# EAGLE design voltage-selector-and-output (EAGLE 7.4.0)
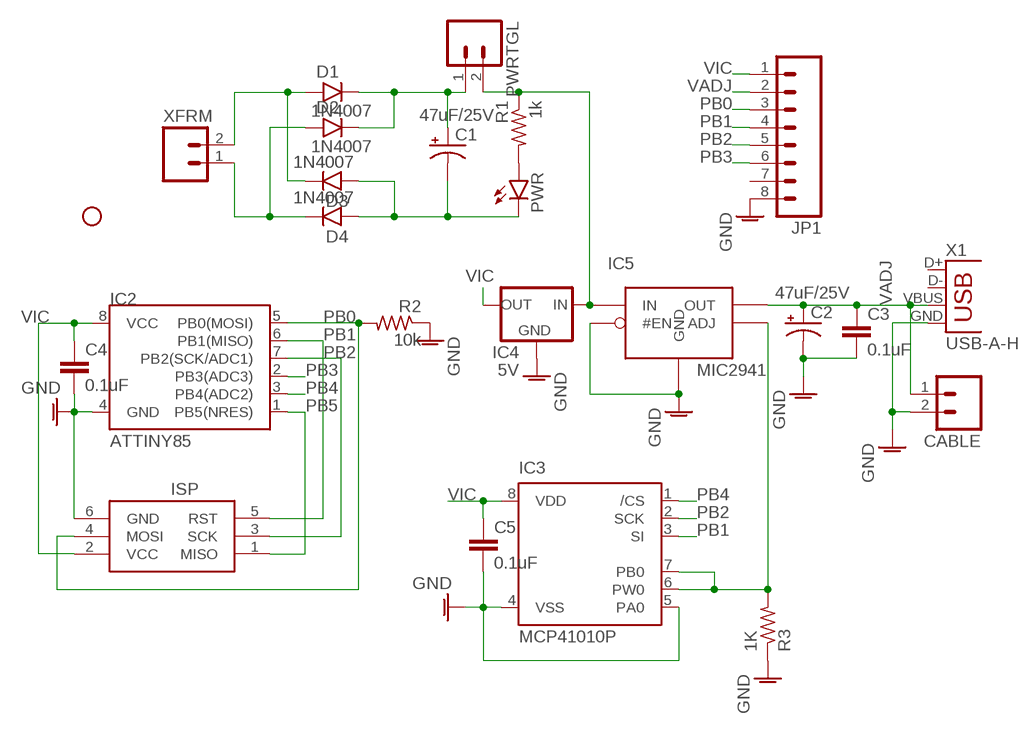
[diagram p0: schematic, sheet 1]

## Parts
C1  47uF/25V  CPOL-USE2.5-6  [E2,5-6]
C2  47uF/25V  CPOL-USE2.5-6  [E2,5-6]
C3  0.1uF  CAPPTH  [CAP-PTH-SMALL]
C4  0.1uF  CAPPTH  [CAP-PTH-SMALL]
C5  0.1uF  CAPPTH  [CAP-PTH-SMALL]
CABLE  M02PTH  [1X02]
D1  1N4007  1N400X.3  [DO41-3]
D2  1N4007  1N400X.3  [DO41-3]
D3  1N4007  1N400X.3  [DO41-3]
D4  1N4007  1N400X.3  [DO41-3]
IC2  ATTINY85  ATTINY13DIP  [DIP08]
IC3  MCP41010P  [DIL8]
IC4  5V  78XXS  [78XXS]
IC5  MIC2941  [TO220-5]
ISP  AVRISP-6  [AVRISP]
JP1  M081X08  [1X08]
PWR  LED-3MM-NO_SILK  [LED3MM-NS]
PWRTGL  M02PTH  [1X02]
R1  1k  R-US_0207/5V  [0207/5V]
R2  10k  R-US_0207/5V  [0207/5V]
R3  1K  R-US_0207/5V  [0207/5V]
STANDOFF1  STAND-OFF  [STAND-OFF]
X1  USB-A-H  [USB-A-H]
XFRM  M02PTH  [1X02]

## Nets
AGND: C2.- C3.2 C4.2 C5.2 CABLE.2 IC2.4(GND) IC3.4(VSS) IC3.5(PA0) IC4.GND IC5.2(#EN) IC5.3(GND) ISP.6(GND) JP1.8 R2.1 R3.1 X1.GND ; supply symbol labelled GND
GND: D2.A D4.C XFRM.1
N$1: IC3.6(PW0) IC3.7(PB0) IC5.1(ADJ) R3.2
N$2: D1.A D3.C XFRM.2
N$5: C1.- D3.A D4.A PWR.K(C)
N$9: C1.+ D1.C D2.C PWRTGL.1
N$10: PWR.A R1.2
PB0: IC2.5(PB0(MOSI)) ISP.4(MOSI) JP1.3 R2.2
PB1: IC2.6(PB1(MISO)) IC3.3(SI) ISP.5(RST) JP1.4
PB2: IC2.7(PB2(SCK/ADC1)) IC3.2(SCK) ISP.3(SCK) JP1.5
PB3: IC2.2(PB3(ADC3)) JP1.6
PB4: IC2.3(PB4(ADC2)) IC3.1(/CS)
PB5: IC2.1(PB5(NRES)) ISP.1(MISO)
VADJ: C2.+ C3.1 CABLE.1 IC5.5(OUT) JP1.2 X1.VBUS
VCC: IC4.IN IC5.4(IN) PWRTGL.2 R1.1
VIC: C4.1 C5.1 IC2.8(VCC) IC3.8(VDD) IC4.OUT ISP.2(VCC) JP1.1
Unconnected: JP1.7 X1.D+ X1.D-

## Library data of the parts
C1 C2 = minimidi:CPOL-US: POLARIZED CAPACITOR, American symbol
C3-C5 = SparkFun-Capacitors:CAP: Capacitor Standard 0603 ceramic capacitor, and 0.1" leaded capacitor.
CABLE PWRTGL XFRM = SparkFun:M02: Header 2 Standard 2-pin 0.1" header. Use with straight break away headers (SKU : PRT-00116), right angle break away headers (PRT-00553), swiss pins (PRT-00743), machine pins (PRT-00117), and female headers (PRT-00115). Molex polarized connector foot print use with SKU : PRT-08233 with associated crimp pins and housings.
D1-D4 = gm-diodes:1N400X: Rectifier Diodes often used in power supply to prevent damage from reverse polarization
IC2 = SparkFun:ATTINY13
IC3 = microchip-custom:MCP41010: DIGITAL POTENTIOMETER 10 kOhm; MF: MICROCHIP; MPN: MCP41010
IC4 = v-reg:78XXS: VOLTAGE REGULATOR
IC5 = bbsup:MIC2941
ISP = adafruit:AVRISP: AVR ISP HEADER Standard 6 pin header for AVR programming
JP1 = SparkFun:M08: Header 8 Standard 8-pin 0.1" header. Use with straight break away headers (SKU : PRT-00116), right angle break away headers (PRT-00553), swiss pins (PRT-00743), machine pins (PRT-00117), and female headers (PRT-00115).
PWR = SparkFun-LED:LED: LEDs Standard schematic elements and footprints for 5mm, 3mm, 1206, and 0603 sized LEDs. 5mm - Spark Fun Electronics SKU : COM-00529 (and others)
R1-R3 = rcl-ez:R-US_: RESISTOR, American symbol
STANDOFF1 = SparkFun-Electromechanical:STAND-OFF: #4 Stand Off This is the mechanical footprint for a #4 phillips button head screw. Use the keepout ring to avoid running the screw head into surrounding components. SKU : PRT-00447
X1 = SparkFun-Connectors:USB: USB Connectors USB-B-PTH is fully proven SKU : PRT-00139/CONN-08278 USB-miniB is fully proven SKU : PRT-00587 USB-A-PCB is untested. USB-A-H is throughly reviewed, but untested. Spark Fun Electronics SKU : PRT-00437 USB-B-SMT is throughly reviewed, but untested. Needs silkscreen touching up. USB-A-S has not been used/tested USB-MB-H has not been used/tested USB-MICROB has been used. CONN-09505; PROD_ID: CONN-08367

## Net classes
1 power: width 0.61 mm

## Board
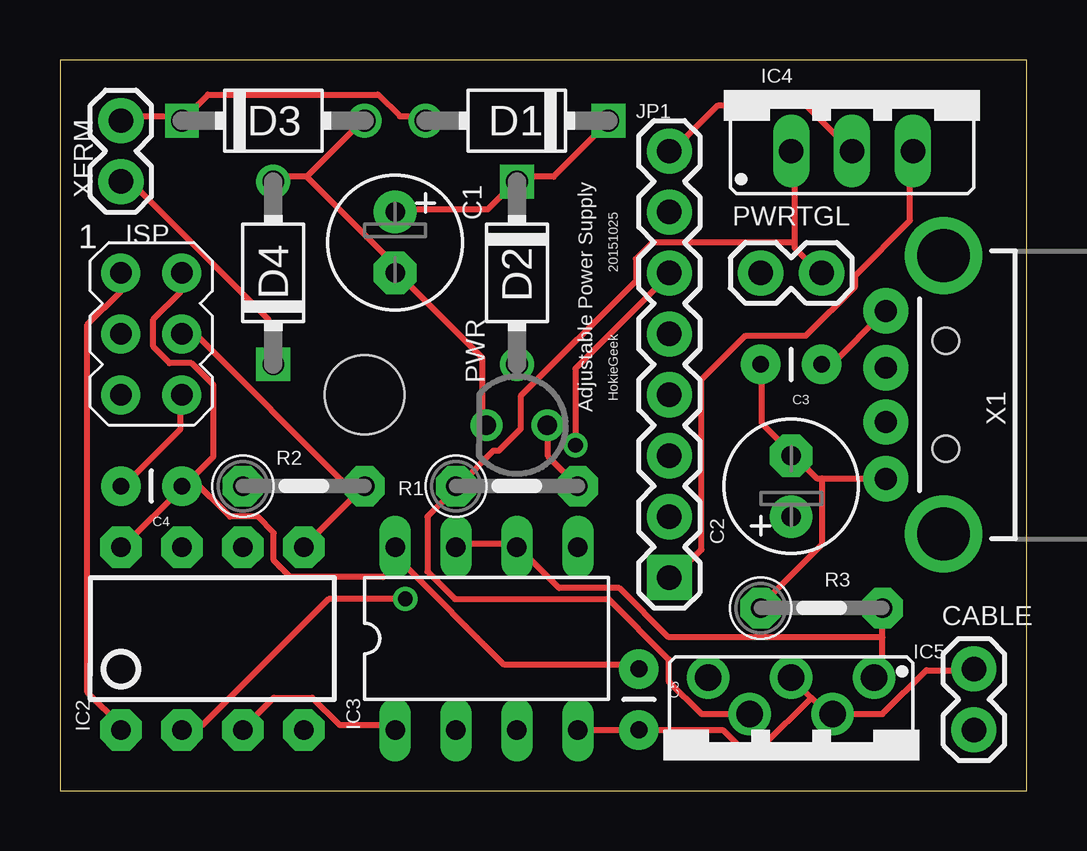
[diagram p1: board, top side]
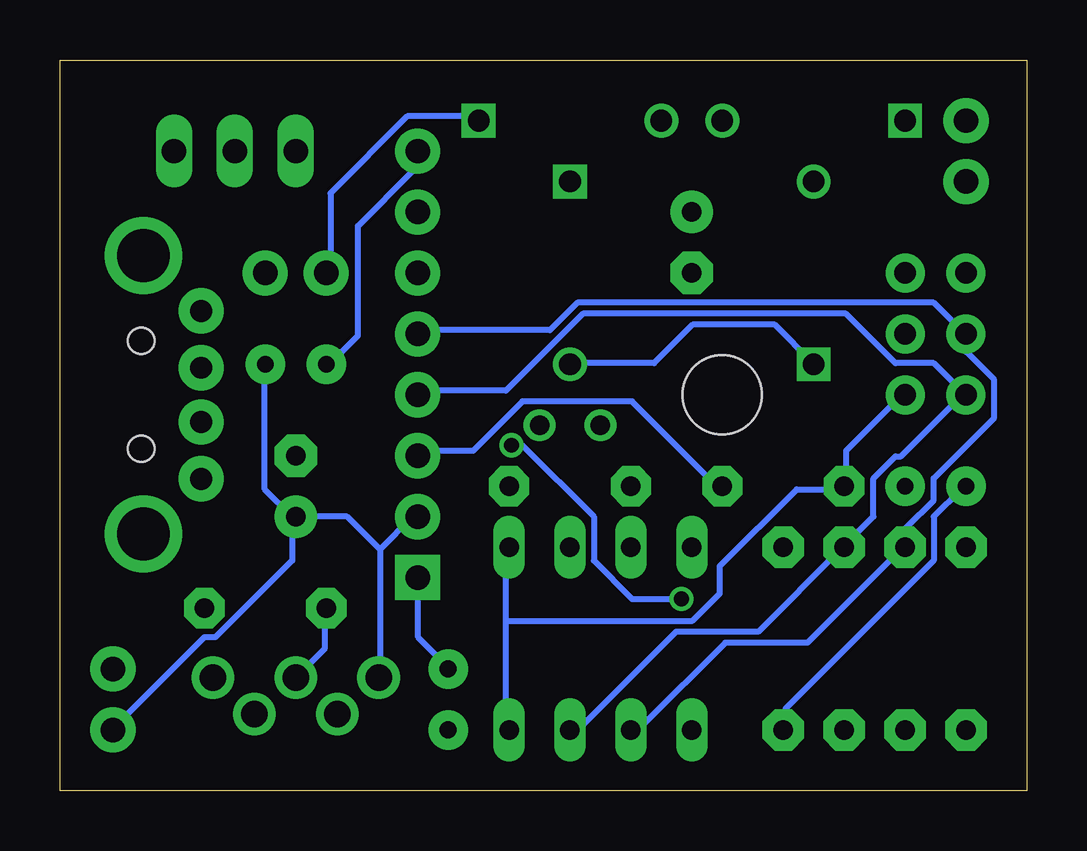
[diagram p2: board, bottom side, seen from below]

Size 40.31 x 30.47 mm. Coordinates in mm from the lower left corner, seen from the top.
Outline: 0,0 40.31,0 40.31,30.47 0,30.47 0,0
Copper layers (1*16): Top 0.035mm / dielectric 1.5mm / Bottom 0.035mm
Design rules "default": minimum track width 10mil, minimum drill 24mil, track to track 8mil, track to pad 8mil, pad to pad 8mil, via to via 8mil, smd to smd 8mil, copper to edge 40mil, drill to drill 8mil, minimum pad ring 10mil, minimum via ring 8mil, stop-mask expansion 4mil, vias tented up to drill 0mil, thermal gap 10mil

### Footprints (pad centres in the part's own frame; a part is rotated, then mirrored left to right if it is on the bottom)
E2,5-6 = drill 0.813 pad 1.778: + -1.27,0 | drill 0.813 pad 1.778 octagon: - 1.27,0
CAP-PTH-SMALL = drill 0.7 pad 1.651: 1 0,0; 2 2.54,0
1X02 = drill 1.016 pad 1.88: 1 0,0; 2 2.54,0
DO41-3 = drill 0.9: A 3.81,0 | drill 0.9 square: C -3.81,0
DIP08 = drill 0.813 pad 1.727 octagon: 1 -3.81,-3.81; 2 -1.27,-3.81; 3 1.27,-3.81; 4 3.81,-3.81; 5 3.81,3.81; 6 1.27,3.81; 7 -1.27,3.81; 8 -3.81,3.81
DIL8 = drill 0.813 long: 1 -3.81,-3.81; 2 -1.27,-3.81; 3 1.27,-3.81; 4 3.81,-3.81; 5 3.81,3.81; 6 1.27,3.81; 7 -1.27,3.81; 8 -3.81,3.81
78XXS = drill 1.016 long: GND 0,-2.54; IN -2.54,-2.54; OUT 2.54,-2.54
TO220-5 = drill 1.1 pad 1.778: 1 -3.454,-3.454; 2 -1.727,-1.93; 3 0,-3.454; 4 1.727,-1.93; 5 3.454,-3.454
AVRISP = drill 0.9 pad 1.626: 1 -1.27,2.54; 2 1.27,2.54; 3 -1.27,0; 4 1.27,0; 5 -1.27,-2.54; 6 1.27,-2.54
1X08 = drill 1.016 pad 1.88 square: 1 0,0 | drill 1.016 pad 1.88: 2 2.54,0; 3 5.08,0; 4 7.62,0; 5 10.16,0; 6 12.7,0; 7 15.24,0; 8 17.78,0
LED3MM-NS = drill 0.813: A -1.27,0; K 1.27,0
0207/5V = drill 0.813 pad 1.676 octagon: 1 -2.54,0; 2 2.54,0
STAND-OFF = hole 3.302: 0,0
USB-A-H = drill 0.914 pad 1.88: D+ 2.4,1.127; D- 2.4,-1.127; GND 2.4,3.5; VBUS 2.4,-3.5 | drill 2.2: GND2 0,-5.8; GND3 0,5.8 | hole 1.1: -0.1,2.25; -0.1,-2.25

### Placement (x,y rotation side)
C1  13.97,22.86 270 top
C2  30.48,12.7 90 top
C3  31.75,17.78 180 top
C4  5.08,12.7 180 top
C5  24.13,5.08 270 top
CABLE  38.1,2.54 90 top
D1  19.05,27.94 180 top
D2  19.05,21.59 270 top
D3  8.89,27.94 0 top
D4  8.89,21.59 90 top
IC2  6.35,6.35 0 top
IC3  17.78,6.35 0 top
IC4  33.02,29.21 0 top
IC5  30.48,1.27 180 top
ISP  3.81,19.05 0 top
JP1  25.4,8.89 90 top
PWR  19.05,15.24 180 top
PWRTGL  29.21,21.59 0 top
R1  19.05,12.7 0 top
R2  10.16,12.7 0 top
R3  31.75,7.62 0 top
STANDOFF1  12.7,16.51 0 top
X1  36.83,16.51 180 top
XFRM  2.54,25.4 90 top

### Tracks (layer width: path | path; a pad name or v marks a point on that pad's centre or on a via)
AGND
  Top 0.254: IC4.GND 32.92,26.75 31.09,28.57 27.43,28.57 25.6,26.75 JP1.8 | C3.2 29.26,17.6 29.26,15.32 30.4,14.17 C2.- 30.63,13.95 31.55,13.03 31.77,13.03 | 31.77,13.03 34.29,13.03 X1.GND | ISP.6 5.03,16.46 5.03,15.09 2.74,12.8 C4.2 | IC3.4 21.72,2.52 24,2.52 C5.2 24.23,2.52 27.66,2.52 28.35,1.83 29.26,1.83 31.32,3.89 | IC5.3 31.32,3.89 | 31.32,3.89 32,3.2 IC5.2 34.29,3.2 36.12,5.03 37.95,5.03 CABLE.2 | 31.77,13.03 31.77,10.29 29.26,7.77 R3.1
  Bottom 0.254: JP1.8 25.6,26.52 25.6,25.83 27.89,23.55 27.89,18.97 29.03,17.83 C3.2 | ISP.6 5.26,16.46 7.54,14.17 7.54,12.8 R2.1 7.77,12.57 9.6,12.57 12.8,9.37 12.8,8.23 13.95,7.09 21.72,7.09 | IC2.4 10.06,2.74 10.06,3.43 3.89,9.6 3.89,11.43 2.74,12.57 C4.2 | 21.72,7.09 21.72,2.74 IC3.4 | 21.72,7.09 21.72,10.06 IC3.5 | IC5.3 29.26,5.94 29.26,7.54 R3.1
GND
  Top 0.254: D4.C 8.69,17.83 8.69,19.66 2.74,25.6 XFRM.1
  Bottom 0.254: D2.A 18.97,17.83 15.54,17.83 13.95,19.43 10.52,19.43 8.91,17.83 D4.C
N$1
  Top 0.254: IC3.7 16.69,10.29 18.97,10.29 IC3.6 19.2,10.06 20.8,8.46 23.32,8.46 25.38,6.4 34.29,6.4 | 34.29,6.4 34.29,5.03 34.06,4.8 IC5.1 | 34.29,6.4 R3.2
N$2
  Top 0.254: XFRM.2 2.74,28.12 5.03,28.12 D3.C 6.17,29.03 13.26,29.03 14.17,28.12 15.09,28.12 D1.A
N$5
  Top 0.254: 10.29,25.6 8.91,25.6 D4.A | 10.29,25.6 12.57,27.89 D3.A | PWR.K 17.6,15.32 17.6,18.06 14.17,21.49 C1.- 14.17,21.72 10.29,25.6
N$9
  Top 0.254: D1.C 22.86,27.89 20.57,25.6 19.2,25.6 D2.C 18.97,25.38 17.83,24.23 14.17,24.23 C1.+
  Bottom 0.254: PWRTGL.1 29.03,21.72 29.03,24.92 25.83,28.12 22.86,28.12 D1.C
N$10
  Top 0.254: R1.2 20.34,13.95 20.34,15.09 PWR.A
PB0
  Top 0.254: ISP.4 5.26,18.97 5.71,18.97 11.89,12.8 12.57,12.8 R2.2 IC2.5
  Bottom 0.254: JP1.3 25.38,14.17 23.09,14.17 21.03,16.23 16.46,16.23 12.8,12.57 R2.2
PB1
  Bottom 0.254: IC3.3 18.97,2.74 18.52,2.74 14.63,6.63 11.2,6.63 7.77,10.06 IC2.6 7.54,10.29 6.4,11.43 6.4,13.03 5.49,13.95 5.26,13.95 2.74,16.46 ISP.5 2.74,16.69 3.89,17.83 5.49,17.83 7.54,19.89 18.52,19.89 21.72,16.69 25.38,16.69 JP1.4
PB2
  Bottom 0.254: IC3.2 16.46,2.74 16,2.74 12.57,6.17 9.14,6.17 5.26,10.06 IC2.7 5.03,10.29 5.03,10.97 3.89,12.12 3.89,13.03 1.37,15.54 1.37,17.14 2.52,18.29 2.52,18.97 ISP.3 2.74,19.2 3.89,20.34 18.75,20.34 19.89,19.2 25.38,19.2 JP1.5
PB3  (via drill 0.61)
  Top 0.254: v14.4,8 11.2,8 5.94,2.74 5.26,2.74 IC2.2 | v21.49,14.4 21.49,17.6 25.38,21.49 JP1.6
  Bottom 0.254: v14.4,8 16.46,8 18.06,9.6 18.06,11.43 21.03,14.4 v21.49,14.4
PB4
  Top 0.254: IC3.1 13.95,2.74 11.66,2.74 10.52,3.89 8.91,3.89 7.77,2.74 IC2.3
PB5
  Top 0.254: ISP.1 2.52,21.49 2.52,20.8 1.14,19.43 1.14,4.12 2.52,2.74 IC2.1
VADJ
  Top 0.254: C3.1 31.77,17.83 32.23,17.83 34.29,19.89 X1.VBUS
  Bottom 0.254: 26.98,10.06 26.98,4.8 IC5.5 | 26.98,10.06 25.6,11.43 JP1.2 | 26.98,10.06 28.35,11.43 C2.+ 30.63,11.43 | 30.63,11.43 30.63,9.6 33.83,6.4 34.29,6.4 37.95,2.74 CABLE.1 | 30.63,11.43 31.77,12.57 31.77,17.6 C3.1
VCC
  Top 0.254: 30.63,22.86 30.63,22.63 31.55,21.72 PWRTGL.2 | 30.63,22.86 30.63,26.52 IC4.IN | 30.63,22.86 24.69,22.86 24,22.17 24,21.26 19.2,16.46 19.2,15.09 18.29,14.17 18.06,14.17 16.69,12.8 R1.1 16.46,12.57 15.32,11.43 15.32,9.14 16.46,8 22.86,8 25.38,5.49 25.38,4.57 26.75,3.2 IC5.4
VIC
  Top 0.254: IC4.OUT 35.43,26.52 35.43,23.77 33.15,21.49 33.15,21.03 31.09,18.97 28.57,18.97 26.75,17.14 26.75,10.06 25.6,8.91 JP1.1 | 5.49,13.03 5.26,12.8 C4.1 | 5.49,13.03 6.4,13.95 6.4,16.92 5.49,17.83 4.57,17.83 3.89,18.52 3.89,19.66 5.03,20.8 5.03,21.49 ISP.2 | IC2.8 2.74,10.29 5.03,12.57 C4.1 | 14.17,9.6 14.17,10.06 IC3.8 14.17,9.6 | 14.17,9.6 18.52,5.26 24,5.26 C5.1 | 5.49,13.03 7.09,11.43 8.23,11.43 8.91,10.74 8.91,9.6 9.6,8.91 13.49,8.91 14.17,9.6 | 5.49,13.03 C4.1
  Bottom 0.254: JP1.1 25.38,8.69 25.38,6.4 24.23,5.26 C5.1

### Text on the board
tPlace: Adjustable Power Supply | 20151025 | HokieGeek